# Altium schematic sheet reefpi_pico_power.SchDoc: reef-pi Pico - Power
size A4; DocumentNumber: 3; Revision: B; SheetNumber: 3; SheetTotal: 8
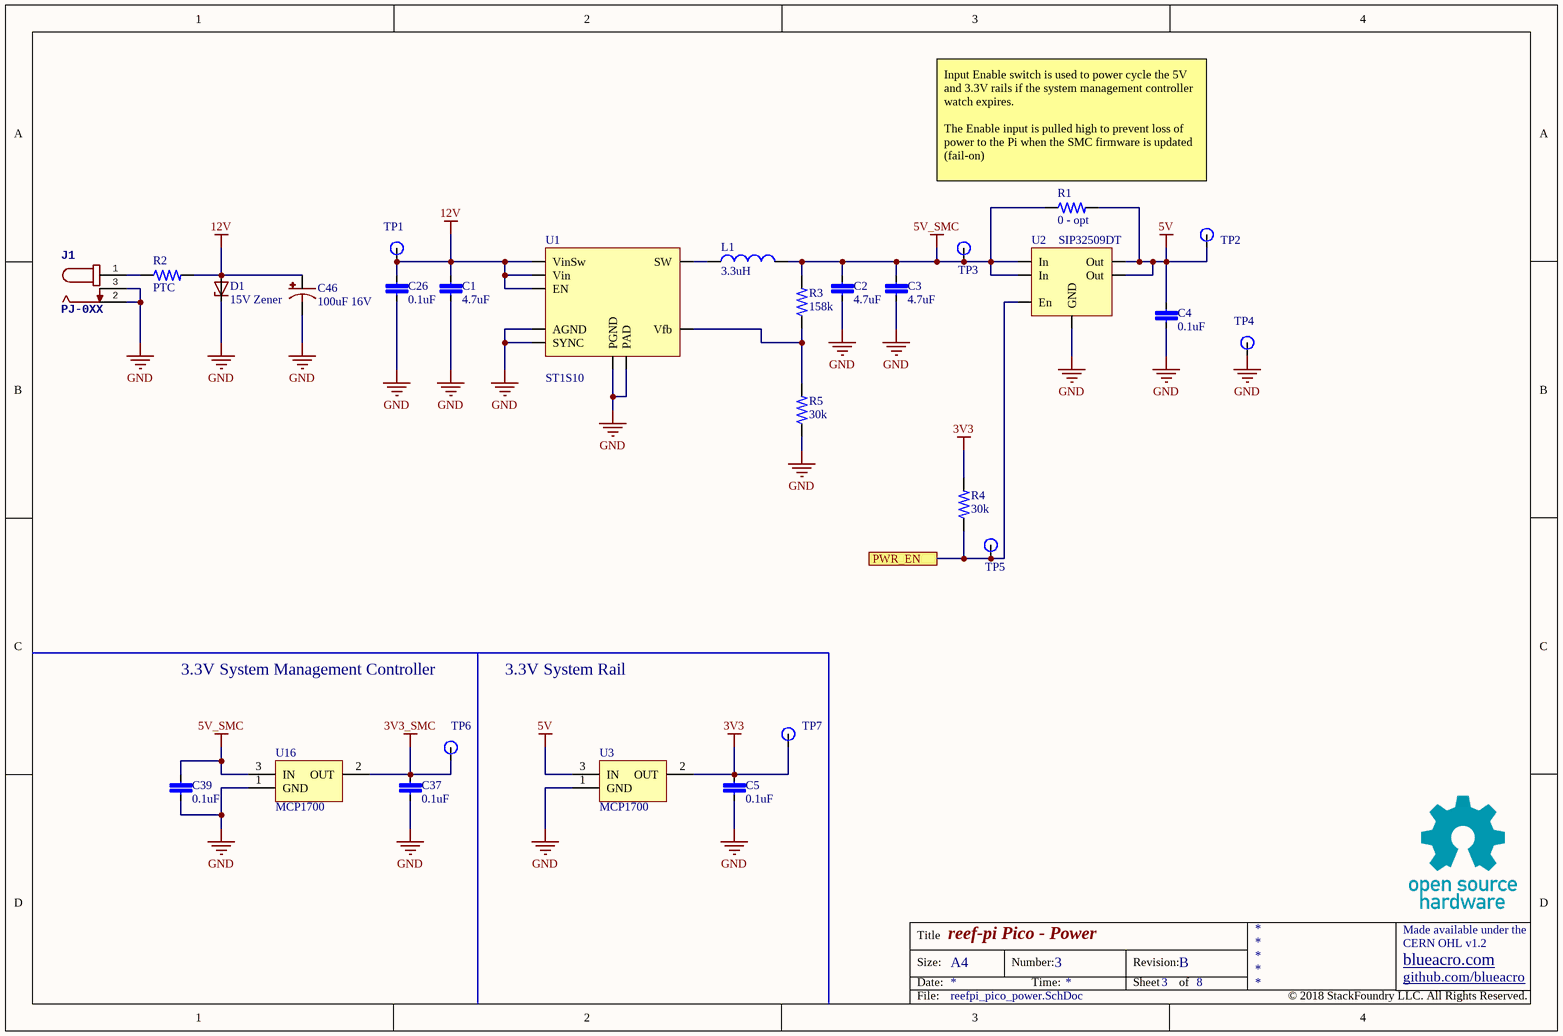
[diagram p0: reefpi_pico_power.SchDoc]

## Parts
C1  4.7uF  [C1210]
C2  4.7uF  [C1210]
C3  4.7uF  [C1210]
C4  0.1uF  [C0603]
C5  0.1uF  [C0603]
C26  0.1uF  [C0603]
C37  0.1uF  [C0603]
C39  0.1uF  [C0603]
C46  100uF 16V  [PANASONIC_D]
D1  15V Zener  [SMA]
J1  PJ-0XX  [PJ-036AH]
L1  3.3uH  [ASPI_0628]
R1  0 - opt  [R1206]
R2  PTC  [R2920]
R3  158k  [R0603]
R4  30k  [R0603]
R5  30k  [R0603]
TP1  TP  [TP_0.89mm]  (value not drawn)
TP2  TP  [TP_0.89mm]  (value not drawn)
TP3  TP  [TP_0.89mm]  (value not drawn)
TP4  TP  [TP_0.89mm]  (value not drawn)
TP5  TP  [TP_0.89mm]  (value not drawn)
TP6  TP  [TP_0.89mm]  (value not drawn)
TP7  TP  [TP_0.89mm]  (value not drawn)
U1  ST1S10  [VFQFPN8]
U2  SIP32509DT  [SOT23-6]
U3  MCP1700  [SOT23]
U16  MCP1700  [SOT23]

## Ports
PWR_EN

## Nets
3V3: C5.1 R4.2 TP7.1 U3.2(OUT)
3V3_SMC: C37.1 TP6.1 U16.2(OUT)
5V: C4.1 R1.2 TP2.1 U2.1(Out) U2.2(Out) U3.3(IN)
5V_SMC: C2.1 C3.1 C39.1 L1.2 R1.1 R3.2 TP3.1 U2.5(In) U2.6(In) U16.3(IN)
12V: C1.1 C26.1 C46.+ D1.A R2.2 TP1.1 U1.1(Vin) U1.2(EN) U1.6(VinSw)
GND: C1.2 C2.2 C3.2 C4.2 C5.2 C26.2 C37.2 C39.2 C46.- D1.C J1.2 J1.3 R5.1 TP4.1 U1.4(AGND) U1.5(SYNC) U1.8(PGND) U1.PAD U2.4(GND) U3.1(GND) U16.1(GND)
PWR_EN: R4.1 TP5.1 U2.3(En) ; port PWR_EN
NetJ1_1: J1.1 R2.1
NetL1_1: L1.1 U1.7(SW)
NetR3_1: R3.1 R5.2 U1.3(Vfb)

## Notes on the sheet
- (near R1) Input Enable switch is used to power cycle the 5V and 3.3V rails if the system management controller watch expires.
  The Enable input is pulled high to prevent loss of power to the Pi when the SMC firmware is updated (fail-on)
- 3.3V System Management Controller
- 3.3V System Rail
- Title
- Size:
- Date:
- A4
- Number:
- Time:
- Revision:
- Sheet
- of
- github.com/blueacro
- blueacro.com
- CERN OHL v1.2
- Made available under the
- File:
- © 2018 StackFoundry LLC. All Rights Reserved.

## Library data of the parts
C1-C5 C26 C37 C39 = C-EU
C46 = CPOL-US
D1 = ZENER-DIODE
L1 = L-US
R1-R5 = R-US